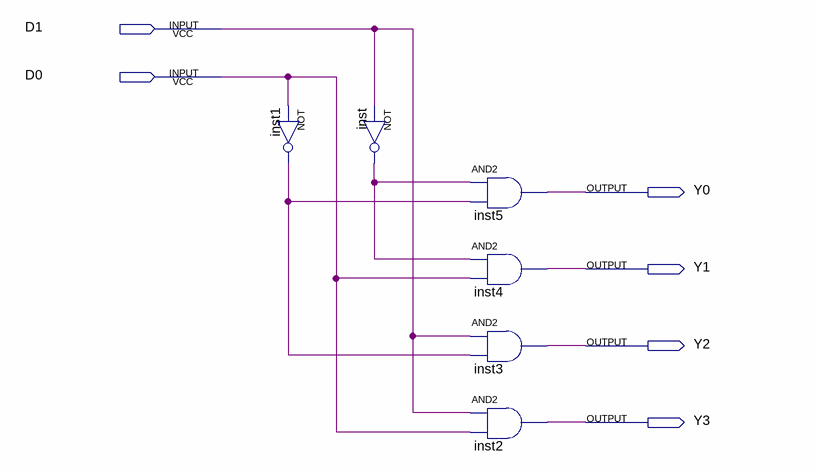
[diagram p0: schematic sheet]
// Quartus schematic 2TO4_Decoder.bdf as structural Verilog: 6 symbols, 6 pins
module \2TO4_Decoder  (
  input  D1,
  input  D0,
  output Y0,
  output Y1,
  output Y2,
  output Y3
);

  wire inst1_out, inst_out;

  not inst1 (inst1_out, D0);
  not inst (inst_out, D1);
  and inst5 (Y0, inst_out, inst1_out);
  and inst4 (Y1, inst_out, D0);
  and inst3 (Y2, D1, inst1_out);
  and inst2 (Y3, D1, D0);
endmodule
